# Altium schematic sheet MPU6050 Schematic.SchDoc
size A4; SheetNumber: 1; SheetTotal: 1
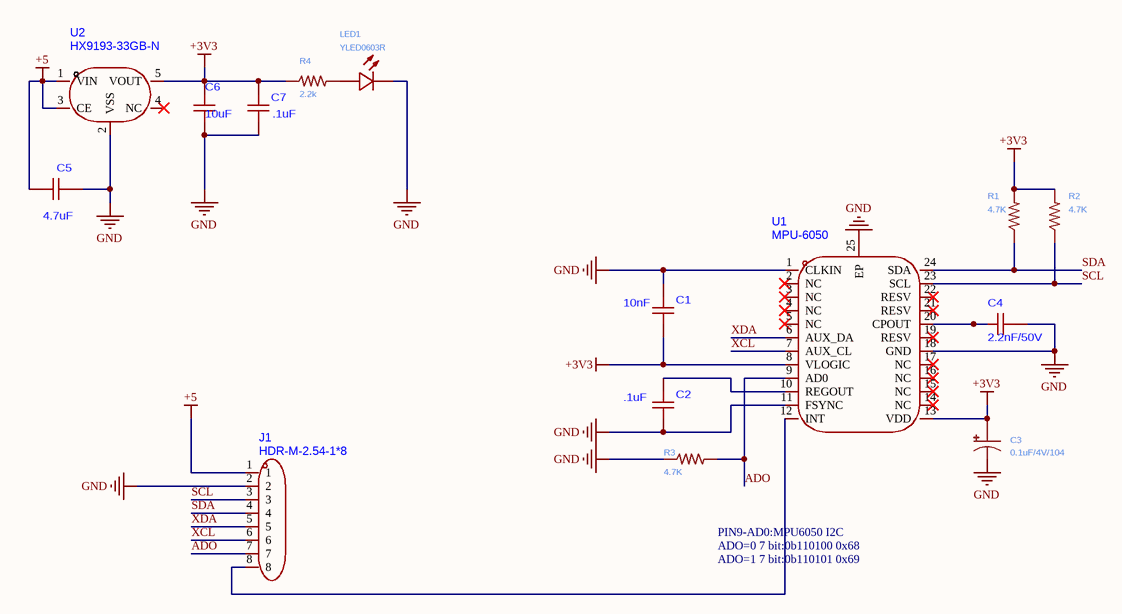
[diagram p0: MPU6050 Schematic.SchDoc]

## Parts
C1  10nF  [C0402]
C2  .1uF  [C0402]
C3  0.1uF/4V/104  [CAP-SMD_L3.2-W1.6-RD]
C4  2.2nF/50V  [C0402]
C5  4.7uF  [C0402]
C6  10uF  [C0402]
C7  .1uF  [C0402]
J1  HDR-M-2.54-1*8  [HDR-TH_8P-P2.54-V-M]
LED1  YLED0603R  [LED0603-FD]
R1  4.7K  [0603]
R2  4.7K  [0603]
R3  4.7K  [0603]
R4  2.2k  [0603]
U1  MPU-6050  [QFN-24_L4.0-W4.0-P0.50-BL-EP2.7]
U2  HX9193-33GB-N  [SOT-23-5_L2.9-W1.6-P0.95-LS2.8-BL]

## Nets
+3V3: C1.2 C3.1 C6.2 C7.2 R1.2 R2.2 R4.1 U1.8(VLOGIC) U1.13(VDD) U2.5(VOUT)
+5: C5.2 J1.1 U2.1(VIN) U2.3(CE)
GND: C1.1 C2.2 C4.1 C5.1 C6.1 C7.1 J1.2 LED1.2(-) R3.1 U1.1(CLKIN) U1.11(FSYNC) U1.18(GND) U1.25(EP) U2.2(VSS)
ADO: J1.7 R3.2 U1.9(AD0)
SCL: J1.3 R2.1 U1.23(SCL)
SDA: J1.4 R1.1 U1.24(SDA)
XCL: J1.6 U1.7(AUX_CL)
XDA: J1.5 U1.6(AUX_DA)
NetC2_1: C2.1 U1.10(REGOUT)
NetC4_2: C4.2 U1.20(CPOUT)
NetJ1_8: J1.8 U1.12(INT)
NetLED1_1: LED1.1(+) R4.2

Not connected (* = marked no-connect by the designer): C3 2; U1 2(NC)* 3(NC)* 4(NC)* 5(NC)* 14(NC)* 15(NC)* 16(NC)* 17(NC)* 19(RESV)* 21(RESV)* 22(RESV)*; U2 4(NC)*

## Notes on the sheet
- PIN9-AD0:MPU6050 I2C
- ADO=0 7 bit:0b110100 0x68
- ADO=1 7 bit:0b110101 0x69
- Labels drawn without touching a wire or pin: GND

## Library data of the parts
C1 C2 C4-C7 = 1UF-C0402
C3 = 293D155X0010A2TE3
J1 = 2.54-1*8: Manufacturer: ZHOURI(洲日); Add into BOM: yes; Pin Structure: 1x8P; Pitch: 2.54mm; Symbol: 2.54-1*8; Device: 2.54-1*8; LCSC Part Name: 2.54-1*8; Supplier Part: C5156616; Manufacturer Part: 2.54-1*8; Supplier Footprint: 插件,P=2.54mm; JLCPCB Part Class: Extended Part; Datasheet: https://atta.szlcsc.com/upload/public/pdf/source/20250227/F941FC765EF241ABFB2D5D72948A31A5.pdf; Supplier: LCSC; Convert to PCB: yes; Number of Rows: Single Row; Number of Pins: 8P
LED1 = YLED0603R: Manufacturer: YONGYUTAI(永裕泰); Add into BOM: yes; Emitted Color: Red; Forward Voltage (VF): 1.8V~2.4V; Forward Current: 25mA; Dominant Wavelength: 620nm~625nm; Symbol: YLED0603R; Device: YLED0603R; LCSC Part Name: YLED0603R; Supplier Part: C19171390; Manufacturer Part: YLED0603R; Supplier Footprint: 0603; JLCPCB Part Class: Extended Part; Datasheet: https://atta.szlcsc.com/upload/public/pdf/source/20231027/FB19AF06E2C70028E58AB5CEDD1BDC72.pdf; Supplier: LCSC; Convert to PCB: yes; Power Dissipation: -; Peak Wavelength: -; Diode Configuration: -; Lens Color: -; Color Temperature: -; Luminous Intensity: -; Viewing Angle: -; Mounting Sytle: -; Operating Temperature: -40℃~+85℃
R1-R4 = R_USA
U1 = MPU-6050: Manufacturer: TDK InvenSense(应美盛); Symbol: MPU-6050_C24112; Add into BOM: yes; Sensor Type: 加速度计陀螺仪; Device: MPU-6050; LCSC Part Name: MPU-6050; Supplier Part: C24112; Manufacturer Part: MPU-6050; Supplier Footprint: QFN-24-EP(4x4); JLCPCB Part Class: Extended Part; Datasheet: https://atta.szlcsc.com/upload/public/pdf/source/20140425/1457707046159.pdf; Supplier: LCSC; Convert to PCB: yes; Operating Temperature: -40℃~+85℃
U2 = HX9193-33GB-N: Manufacturer: HX(恒佳兴); Add into BOM: yes; Output Voltage: 3.3V; Output Current: 300mA; Symbol: HX9193-33GB-N; Device: HX9193-33GB-N; LCSC Part Name: HX9193-33GB-N; Supplier Part: C2995655; Manufacturer Part: HX9193-33GB-N; Supplier Footprint: SOT-23-5; JLCPCB Part Class: Extended Part; Datasheet: https://atta.szlcsc.com/upload/public/pdf/source/20220412/18D9B33FD58646224E88440BBF52FED7.pdf; Supplier: LCSC; Convert to PCB: yes; Output Type: -; Voltage - Supply: -; Power Supply Rejection Ratio (PSRR): -; Voltage Dropout: -; standby current: -; Noise: -; Features: Low ESR；Overcurrent Protection(OCP)；With ability; Operating Temperature: -; Output Configuration: -; Number of Outputs: -